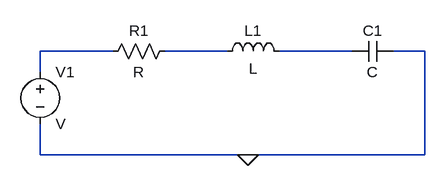
[diagram p0: schematic RLC Circuit.asc]
RLC Circuit.asc, the LTspice schematic file:
Version 4.1
SHEET 1 880 680
WIRE 208 96 96 96
WIRE 384 96 288 96
WIRE 576 96 464 96
WIRE 688 96 640 96
WIRE 96 128 96 96
WIRE 96 256 96 208
WIRE 416 256 96 256
WIRE 688 256 688 96
WIRE 688 256 416 256
FLAG 416 256 0
SYMBOL voltage 96 112 R0
SYMATTR InstName V1
SYMBOL res 304 80 R90
WINDOW 0 0 56 VBottom 2
WINDOW 3 32 56 VTop 2
SYMATTR InstName R1
SYMBOL ind 368 112 R270
WINDOW 0 32 56 VTop 2
WINDOW 3 5 56 VBottom 2
SYMATTR InstName L1
SYMBOL cap 640 80 R90
WINDOW 0 0 32 VBottom 2
WINDOW 3 32 32 VTop 2
SYMATTR InstName C1

The netlist it stands for:
* RLC Circuit.asc
V1 N001 0 V
R1 N002 N001 R
L1 N002 N003 L
C1 0 N003 C
.backanno
.end